# Altium schematic sheet Vs.SchDoc
size A4; SheetNumber: 3; SheetTotal: 3
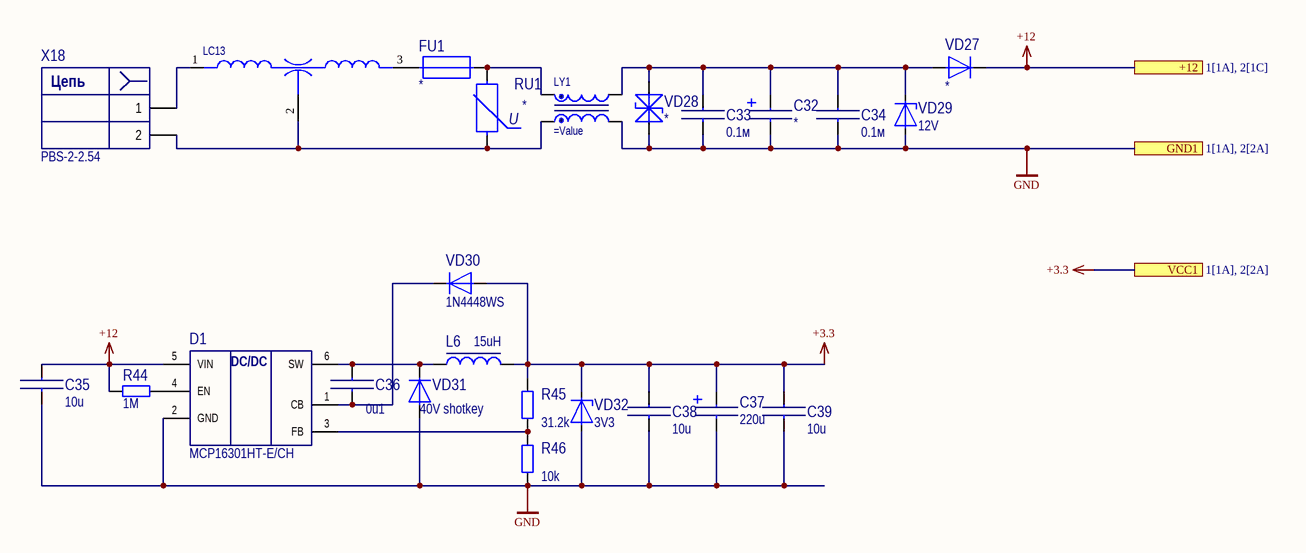
[diagram p0: Vs.SchDoc]

## Parts
C32  *  [ECAP 220 50V]
C33  0.1м  [3216[1206]]
C34  0.1м  [3216[1206]]
C35  10u  [3216[1206]]
C36  0u1  [2012[0805]]
C37  220u  [ECAP 220 50V]
C38  10u  [6332[2512]]
C39  10u  [6332[2512]]
D1  MCP16301HT-E/CH  [SOT23-6]
FU1  *  [2410]
L6  15uH  [IND5750]
LC13  (no value)  [NFE61PT102E1H9L]
LY1  (no value)  [B82793S0513N201]
R44  1М  [2012[0805]]
R45  31.2k  [2012[0805]]
R46  10k  [2012[0805]]
RU1  *  [3225[1210]]
VD27  *  [SMB]
VD28  *  [SMС]
VD29  12V  [SMС]
VD30  1N4448WS  [SOD-323]
VD31  40V shotkey  [SOD-123]
VD32  3V3  [SOD-80]
X18  PBS-2-2.54  [CWF-2]

## Ports
+12 (see 1[1A], 2[1C]), GND1 (see 1[1A], 2[2A]), VCC1 (see 1[1A], 2[2A])

## Nets
+3.3: C37.1 C38.1 C39.1 L6.2 R45.2 VD30.1(A) VD32.2(K) ; port VCC1
+12: C35.1 D1.5(VIN) R44.2 VD27.2(K) ; port +12
GND: C32.2 C33.2 C34.2 C35.2 C37.2 C38.2 C39.2 D1.2(GND) LY1.4 R46.1 VD28.2(K) VD29.1(A) VD31.1(A) VD32.1(A) ; port GND1
NetC32_1: C32.1 C33.1 C34.1 LY1.3 VD27.1(A) VD28.1(A) VD29.2(K)
NetC36_1: C36.1 D1.1(CB) VD30.2(K)
NetC36_2: C36.2 D1.6(SW) L6.1 VD31.2(K)
NetD1_3: D1.3(FB) R45.1 R46.2
NetD1_4: D1.4(EN) R44.1
NetFU1_1: FU1.1 LC13.3(OUTPUT)
NetFU1_2: FU1.2 LY1.1 RU1.2
NetLC13_1: LC13.1(INPUT) X18.1
NetLC13_2: LC13.2(GND) LY1.2 RU1.1 X18.2

## Notes on the sheet
- (in symbol MCP16301) DC/DC
- (in symbol RU Varistor) U
- (in symbol XP-PBS-2) Цепь

## Library data of the parts
C32 C37 = C pol: Конденсатор электролитический; Specification: K; BCPId: *; Power/Voltage: *; Manufacturer: *; ManufacturerPartNumber: *; Rem: *; Package: *; Value: *; Type: Конденсатор; TU/GOST: *; Name: *; TKE/TKC: *; HelpURL: *; Price: *
C33 C34 = C nonpol: Конденсатор; Manufacturer: Murata; ManufacturerPartNumber: GRM21_R71H104; Power/Voltage: 50В; Tolerance: 10%; TKE/TKC: X7R; Specification: K; BCPId: *; Rem: *; Package: *; Value: 0.1м; Type: Конденсатор; TU/GOST: *; Name: *; HelpURL: *; Price: *
C35 C36 C38 C39 = C nonpol: Конденсатор; Manufacturer: Murata; ManufacturerPartNumber: GRM21_R71H104; Power/Voltage: 50В; Value: 0.1м; Tolerance: 10%; TKE/TKC: X7R; Specification: K; BCPId: *; Rem: *; Package: *; Type: Конденсатор; TU/GOST: *; Name: *; HelpURL: *; Price: *
D1 = MCP16301: DC/DC regulator; Manufacturer: Microchip; Type: Микросхема; ManufacturerPartNumber: MCP16301HT-E/CH
FU1 = FU: Вставка плавкая; ManufacturerPartNumber: ВП1-2; Power/Voltage: 0.25 А, 250 В; TU/GOST: ОЮ0.480.003ТУ-Р; Specification: K; BCPId: *; Tolerance: *; Rem: *; Package: *; Value: *; Type: Вставка плавкая; Name: *; TKE/TKC: *; HelpURL: *; Price: *
L6 = L with core: Дроссель; Type: Индуктивность; Specification: K; BCPId: *; Power/Voltage: *; Tolerance: *; Manufacturer: *; ManufacturerPartNumber: *; Rem: *; Package: *; Value: *; TU/GOST: *; Name: *; HelpURL: *; Price: *
LC13 = Фильтр ЭМП LCL
LY1 = Дроссель синфазный
R44-R46 = R-4del: Резистор; Manufacturer: Yageo; ManufacturerPartNumber: RC0805JR-07120R; Power/Voltage: 0.125Вт; Tolerance: 5%; Specification: K; BCPId: *; Rem: *; Package: *; Value: *; TU/GOST: *; Type: Резистор; Name: *; TKE/TKC: *; HelpURL: *; Price: *
RU1 = RU Varistor: Варистор; Specification: K; BCPId: *; Manufacturer: *; Rem: *; Package: *; ManufacturerPartNumber: *; Type: Варистор; TU/GOST: *; HelpURL: *; Price: *
VD27 VD30 VD31 = VD Diod: Диод; Specification: K; BCPId: *; Manufacturer: *; Rem: *; Package: *; ManufacturerPartNumber: *; Type: Диод; TU/GOST: *; HelpURL: *; Price: *
VD28 = VD Stabilitron_bidir: Стабилитрон двусторонний; Specification: K; BCPId: *; Manufacturer: *; Rem: *; Package: *; ManufacturerPartNumber: *; Type: Стабилитрон; TU/GOST: *; HelpURL: *; Price: *
VD29 VD32 = VD Stabilitron: Стабилитрон односторонний; Specification: K; BCPId: *; Manufacturer: *; Rem: *; Package: *; ManufacturerPartNumber: *; Type: Стабилитрон; TU/GOST: *; HelpURL: *; Price: *
X18 = XP-PBS-2: Гнездо 2-контакта; Specification: K; BCPId: *; Manufacturer: *; ManufacturerPartNumber: PBS-2-2.54; Rem: *; Package: *; TU/GOST: *; Type: Розетка; HelpURL: *; Price: *